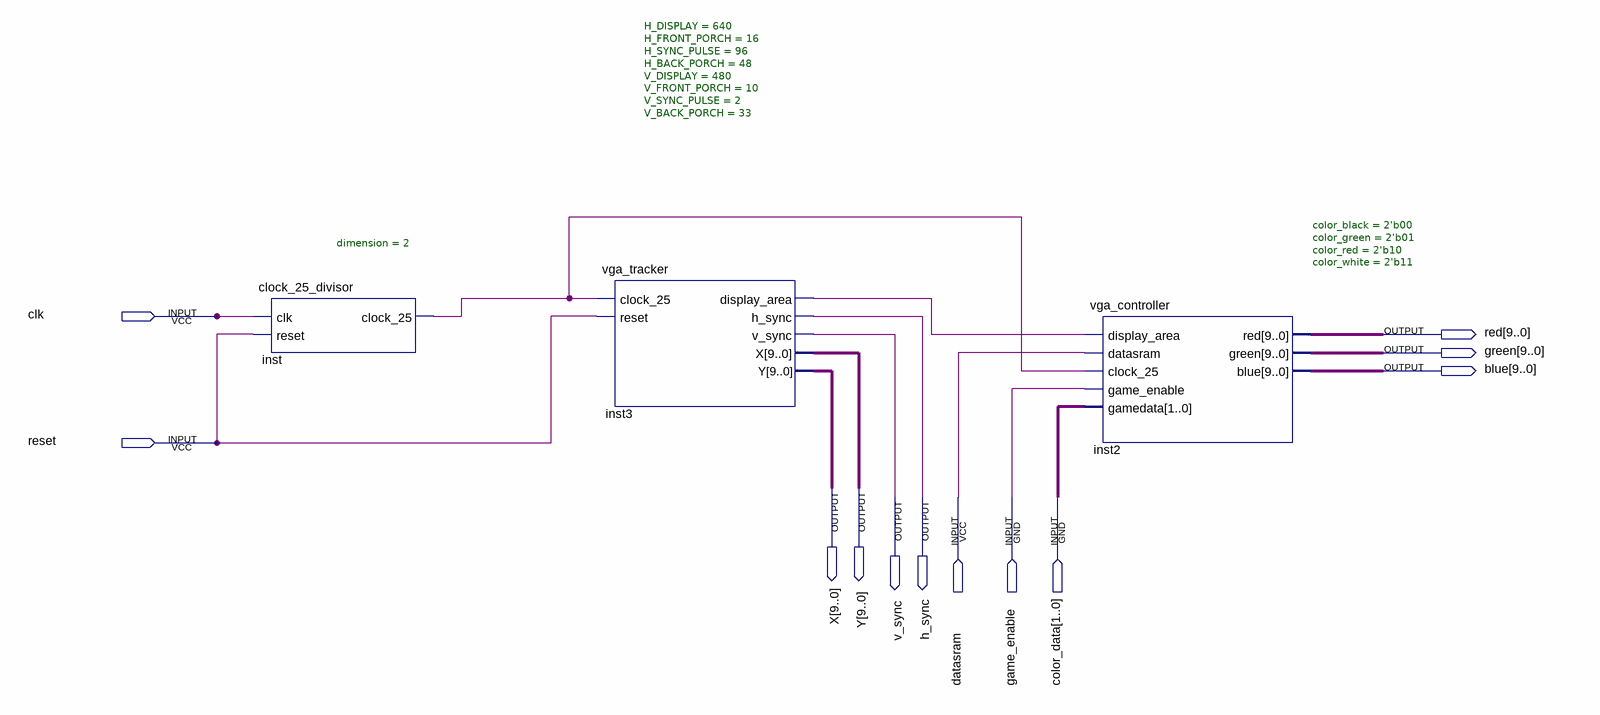
[diagram p0: schematic sheet]
// Quartus schematic vga_wrapper.bdf as structural Verilog: 3 symbols, 12 pins
module vga_wrapper (
  input  clk,
  input  reset,
  input  datasram,
  input  game_enable,
  input  [1:0] color_data,
  output [9:0] red,
  output [9:0] green,
  output [9:0] blue,
  output [9:0] X,
  output [9:0] Y,
  output v_sync,
  output h_sync
);

  wire inst3_display_area, inst_clock_25;

  clock_25_divisor #(.dimension(2)) inst (.clk(clk), .reset(reset), .clock_25(inst_clock_25));
  vga_tracker #(.H_DISPLAY(640), .H_FRONT_PORCH(16), .H_SYNC_PULSE(96), .H_BACK_PORCH(48), .V_DISPLAY(480), .V_FRONT_PORCH(10), .V_SYNC_PULSE(2), .V_BACK_PORCH(33)) inst3 (
    .clock_25(inst_clock_25), .reset(reset), .display_area(inst3_display_area), .h_sync(h_sync),
    .v_sync(v_sync), .X(Y), .Y(X));
  vga_controller #(.color_black(2'b00), .color_green(2'b01), .color_red(2'b10), .color_white(2'b11)) inst2 (
    .display_area(inst3_display_area), .datasram(datasram), .clock_25(inst_clock_25),
    .game_enable(game_enable), .gamedata(color_data), .red(red), .green(green), .blue(blue));
endmodule
